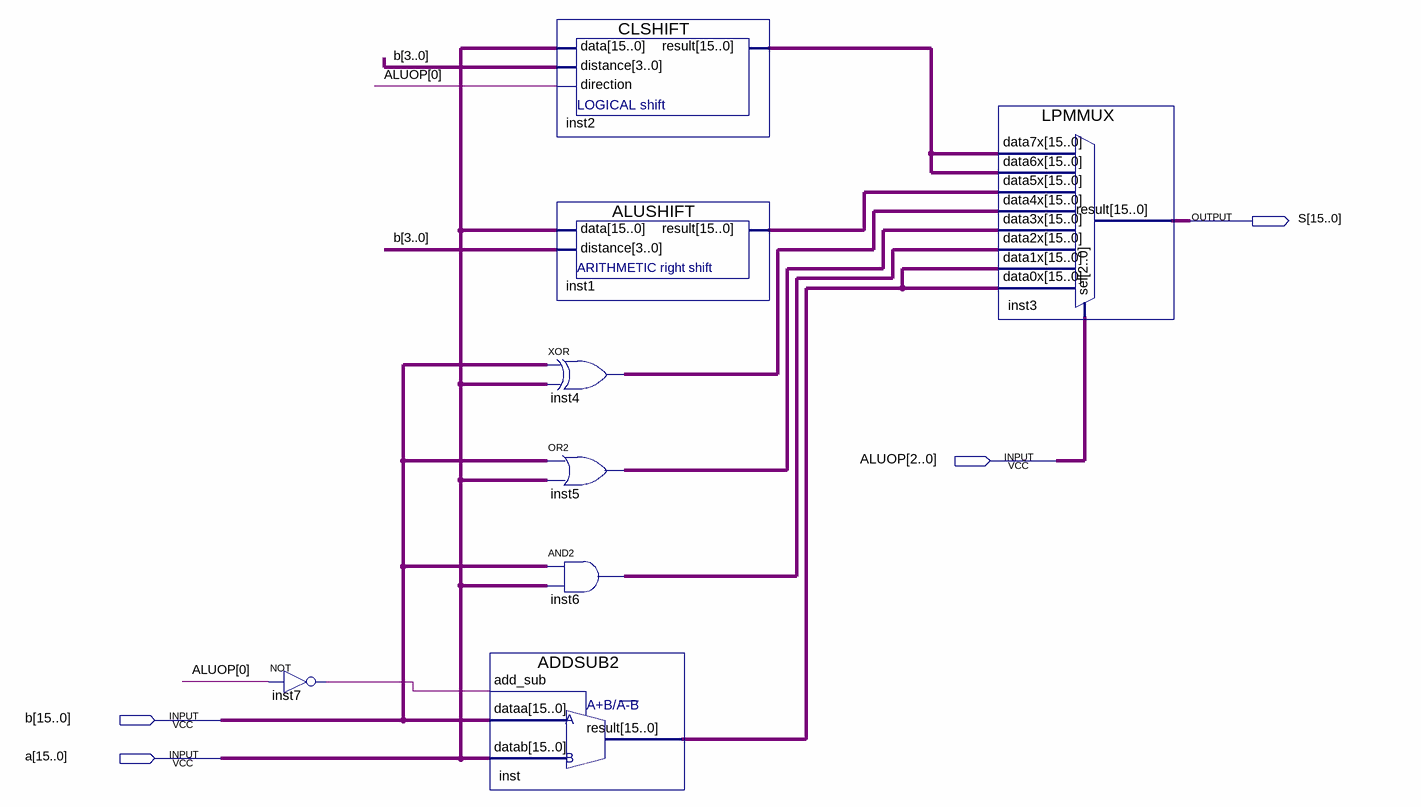
[diagram p0: schematic sheet]
// Quartus schematic lab404ALU.bdf as structural Verilog: 8 symbols, 4 pins
module lab404ALU (
  input  [2:0] ALUOP,
  input  [15:0] b,
  input  [15:0] a,
  output [15:0] S
);

  wire inst7_out;
  wire [15:0] inst1_result, inst2_result, inst4_out, inst5_out, inst6_out, inst_result;

  not inst7 (inst7_out, ALUOP[0]);
  ADDSUB2 inst (.add_sub(inst7_out), .dataa(b), .datab(a), .result(inst_result));
  CLSHIFT inst2 (.data(a), .distance(b[3:0]), .direction(ALUOP[0]), .result(inst2_result));
  ALUSHIFT inst1 (.data(a), .distance(b[3:0]), .result(inst1_result));
  assign inst4_out = b ^ a;  // XOR inst4, 16 bits wide
  assign inst5_out = b | a;  // OR2 inst5, 16 bits wide
  assign inst6_out = b & a;  // AND2 inst6, 16 bits wide
  LPMMUX inst3 (
    .data7x(inst2_result), .data6x(inst2_result), .data5x(inst1_result), .data4x(inst4_out),
    .data3x(inst5_out), .data2x(inst6_out), .data1x(inst_result), .data0x(inst_result), .sel(ALUOP),
    .result(S));
endmodule
